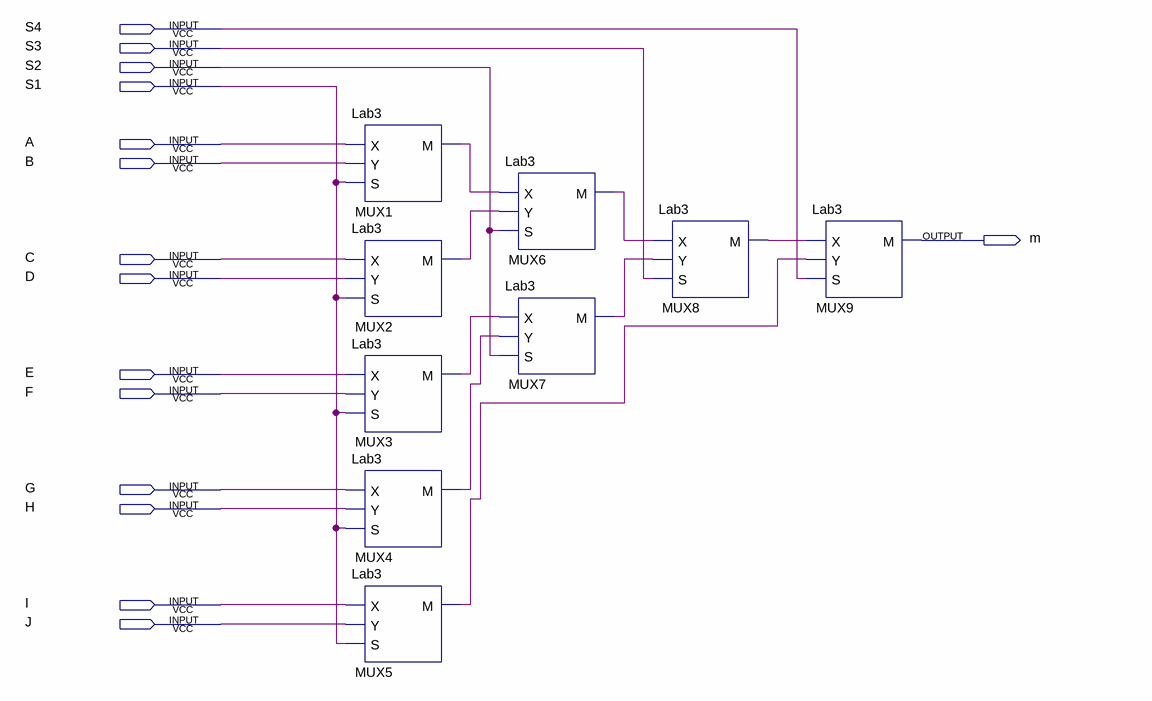
[diagram p0: schematic sheet]
// Quartus schematic 10to1mux.bdf as structural Verilog: 9 symbols, 15 pins
module \10to1mux  (
  input  S4,
  input  S3,
  input  S2,
  input  S1,
  input  A,
  input  B,
  input  C,
  input  D,
  input  E,
  input  F,
  input  G,
  input  H,
  input  I,
  input  J,
  output m
);

  wire MUX1_m, MUX2_m, MUX3_m, MUX4_m, MUX5_m, MUX6_m, MUX7_m, MUX8_m;

  Lab3 MUX1 (.X(A), .Y(B), .S(S1), .M(MUX1_m));
  Lab3 MUX2 (.X(C), .Y(D), .S(S1), .M(MUX2_m));
  Lab3 MUX3 (.X(E), .Y(F), .S(S1), .M(MUX3_m));
  Lab3 MUX4 (.X(G), .Y(H), .S(S1), .M(MUX4_m));
  Lab3 MUX5 (.X(I), .Y(J), .S(S1), .M(MUX5_m));
  Lab3 MUX6 (.X(MUX1_m), .Y(MUX2_m), .S(S2), .M(MUX6_m));
  Lab3 MUX7 (.X(MUX3_m), .Y(MUX4_m), .S(S2), .M(MUX7_m));
  Lab3 MUX8 (.X(MUX6_m), .Y(MUX7_m), .S(S3), .M(MUX8_m));
  Lab3 MUX9 (.X(MUX8_m), .Y(MUX5_m), .S(S4), .M(m));
endmodule
